# EAGLE schematic Dual_TPA6120_V0001 (EAGLE 6.4)

## Sheet 1 of 2: Power Supply
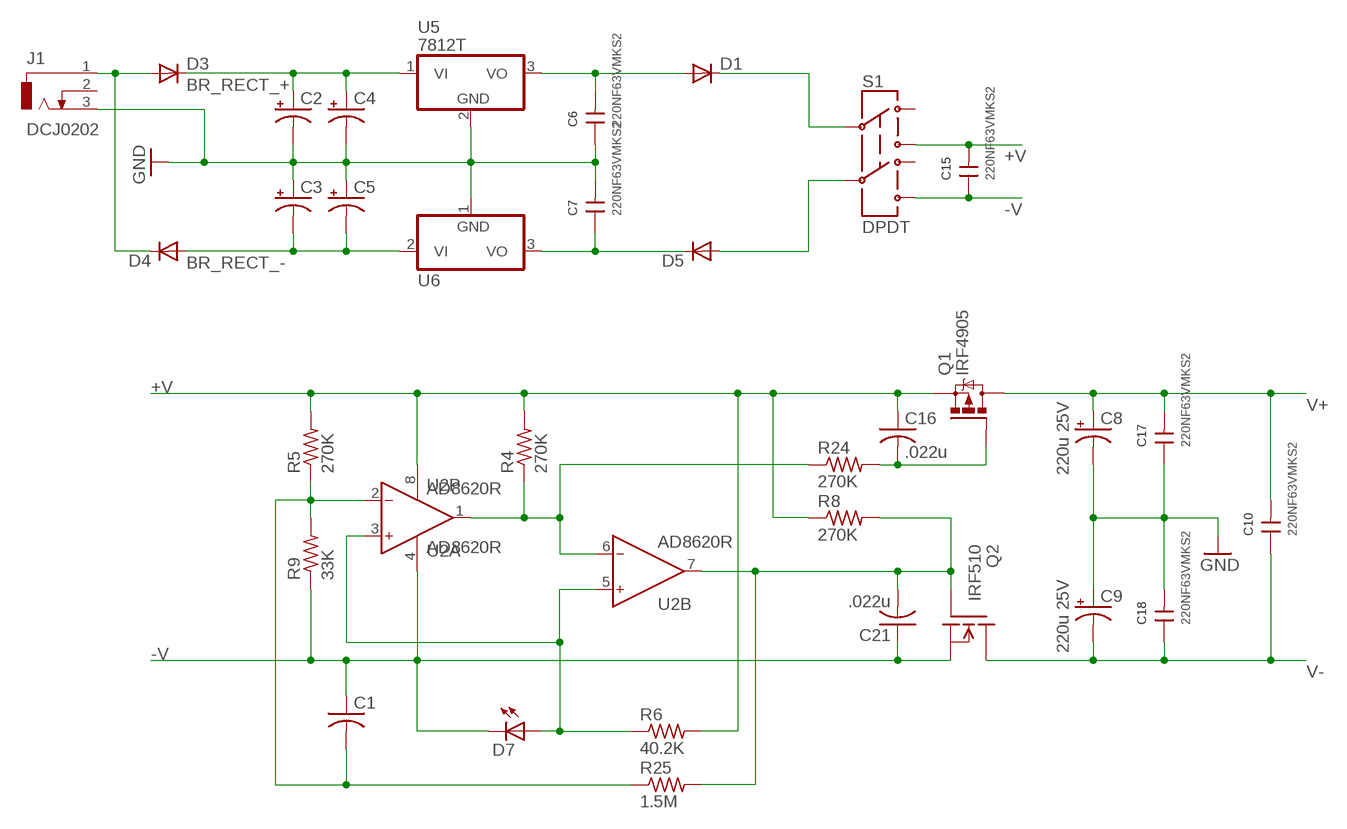
[diagram p0: schematic, sheet 1]

### Parts
C1  C-USC0603  [C0603]
C2  CPOL-USE7.5-16  [E7,5-16]
C3  CPOL-USE7.5-16  [E7,5-16]
C4  CPOL-USE7.5-16  [E7,5-16]
C5  CPOL-USE7.5-16  [E7,5-16]
C6  220NF63VMKS2  [3,0X7,5RM5,0]
C7  220NF63VMKS2  [3,0X7,5RM5,0]
C8  220u 25V  CPOL-USE3.5-10  [E3,5-10]
C9  220u 25V  CPOL-USE3.5-10  [E3,5-10]
C10  220NF63VMKS2  [3,0X7,5RM5,0]
C15  220NF63VMKS2  [3,0X7,5RM5,0]
C16  .022u  C-USC0603  [C0603]
C17  220NF63VMKS2  [3,0X7,5RM5,0]
C18  220NF63VMKS2  [3,0X7,5RM5,0]
C21  .022u  C-USC0603  [C0603]
D1  1N5060GP  [DO15-12]
D3  1N5060GP  [DO15-12]
D4  1N5060GP  [DO15-12]
D5  1N5060GP  [DO15-12]
D7  LED3MM  [LED3MM]
J1  DCJ0202  [DCJ0202]
Q1  IRF4905  [TO220BH]
Q2  IRF510  [TO220]
R4  270K  R-US_R0805  [R0805]
R5  270K  R-US_R0805  [R0805]
R6  40.2K  R-US_R0805  [R0805]
R8  270K  R-US_R0805  [R0805]
R9  33K  R-US_R0805  [R0805]
R24  270K  R-US_R0805  [R0805]
R25  1.5M  R-US_R0805  [R0805]
S1  DPDT  SWITCH-DPDTAYZ0202  [AYZ0202]
U2  AD8620R  [SO8]
U5  7812T  [TO220H]
U6  7912T  [TO220H]

### Nets
+V: C15.2 C16.1 Q1.S R4.2 R5.2 R6.2 R8.1 S1.3 U2.8(P:V+)
-V: C1.1 C15.1 C21.1 D7.K(C) Q2.3(S) R9.1 S1.6 U2.4(P:V-)
BR_RECT_+: C2.+ C4.+ D3.C U5.1(VI)
BR_RECT_-: C3.- C5.- D4.A U6.2(VI)
GND: C2.- C3.+ C4.- C5.+ C6.1 C7.2 C8.- C9.+ C17.1 C18.2 J1.3 U5.2(GND) U6.1(GND) ; also sheet 2
N$1: C6.2 D1.A U5.3(VO)
N$2: C1.2 R5.1 R9.2 R25.1 U2.2(A:IN-)
N$3: C7.1 D5.C U6.3(VO)
N$4: D7.A R6.1 U2.3(A:IN+) U2.5(B:IN+)
N$5: C21.2 Q2.1(G) R8.2 R25.2 U2.7(B:OUT)
N$6: R4.1 R24.1 U2.1(A:OUT) U2.6(B:IN-)
N$9: C16.2 Q1.G R24.2
N$21: D3.A D4.C J1.1
REG+: D1.C S1.2
REG-: D5.A S1.5
V+: C8.+ C10.2 C17.2 Q1.D ; also sheet 2
V-: C9.- C10.1 C18.1 Q2.2(D) ; also sheet 2
Unconnected: J1.2 S1.1 S1.4

## Sheet 2 of 2: Amp Section
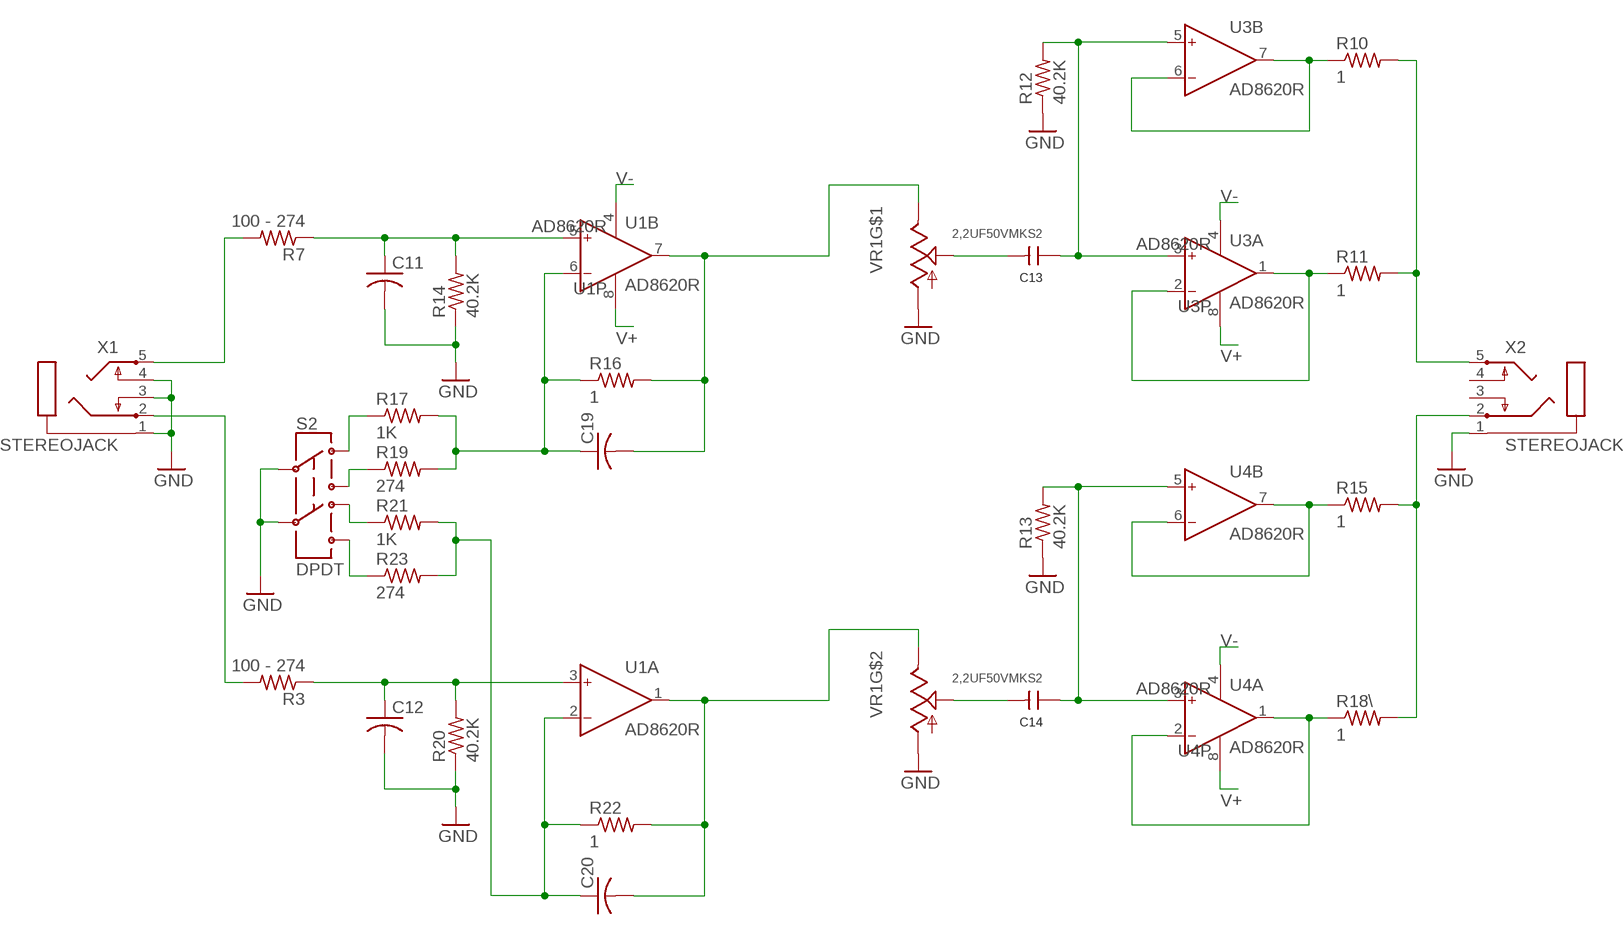
[diagram p1: schematic, sheet 2]

### Parts
C11  C-USC0603  [C0603]
C12  C-USC0603  [C0603]
C13  2,2UF50VMKS2  [7,2X13,0RM5,0]
C14  2,2UF50VMKS2  [7,2X13,0RM5,0]
C19  C-USC0603  [C0603]
C20  C-USC0603  [C0603]
R3  100 - 274  R-US_R1206  [R1206]
R7  100 - 274  R-US_R1206  [R1206]
R10  1  R-US_R1206  [R1206]
R11  1  R-US_R1206  [R1206]
R12  40.2K  R-US_R1206  [R1206]
R13  40.2K  R-US_R1206  [R1206]
R14  40.2K  R-US_R1206  [R1206]
R15  1  R-US_R1206  [R1206]
R16  1  R-US_R1206  [R1206]
R17  1K  R-US_R1206  [R1206]
R18\  1  R-US_R1206  [R1206]
R19  274  R-US_R1206  [R1206]
R20  40.2K  R-US_R1206  [R1206]
R21  1K  R-US_R1206  [R1206]
R22  1  R-US_R1206  [R1206]
R23  274  R-US_R1206  [R1206]
S2  DPDT  SWITCH-DPDTAYZ0202  [AYZ0202]
U1  AD8620R  [SO8]
U3  AD8620R  [SO8]
U4  AD8620R  [SO8]
VR1  ALPS_BLUE  [ALPS_RK27]
X1  STEREOJACK  [STX3100]
X2  STEREOJACK  [STX3100]

### Nets
GND: C11.2 C12.2 R12.1 R13.1 R14.1 R20.1 S2.2 S2.5 VR1.G1 VR1.G2 X1.1 X1.3 X1.4 X2.1 ; also sheet 1
N$7: R10.1 U3.6(B:IN-) U3.7(B:OUT)
N$8: R11.1 U3.1(A:OUT) U3.2(A:IN-)
N$10: R15.1 U4.6(B:IN-) U4.7(B:OUT)
N$11: R18\.1 U4.1(A:OUT) U4.2(A:IN-)
N$12: C19.2 R16.2 U1.7(B:OUT) VR1.I1
N$13: C20.2 R22.2 U1.1(A:OUT) VR1.I2
N$14: C14.2 VR1.O2
N$15: R10.2 R11.2 X2.5
N$17: R15.2 R18\.2 X2.2
N$18: C13.1 R12.2 U3.3(A:IN+) U3.5(B:IN+)
N$19: C14.1 R13.2 U4.3(A:IN+) U4.5(B:IN+)
N$20: C13.2 VR1.O1
N$22: R7.2 X1.5
N$23: R3.2 X1.2
N$24: C11.1 R7.1 R14.2 U1.5(B:IN+)
N$25: C12.1 R3.1 R20.2 U1.3(A:IN+)
N$27: C19.1 R16.1 R17.2 R19.2 U1.6(B:IN-)
N$28: C20.1 R21.2 R22.1 R23.2 U1.2(A:IN-)
N$30: R17.1 S2.1
N$31: R19.1 S2.3
N$32: R21.1 S2.4
N$33: R23.1 S2.6
V+: U1.8(P:V+) U3.8(P:V+) U4.8(P:V+) ; also sheet 1
V-: U1.4(P:V-) U3.4(P:V-) U4.4(P:V-) ; also sheet 1
Unconnected: X2.3 X2.4

## Library data of the parts
C1 C11 C12 C16 C19-C21 = rcl:C-US: CAPACITOR, American symbol
C2-C5 C8 C9 = rcl:CPOL-US: POLARIZED CAPACITOR, American symbol
C6 C7 C10 C15 C17 C18 = wima_c:220NF63V
C13 C14 = wima_c:2,2UF50V
D1 D3-D5 = diode-1:1N5060GP: DIODE controlled avalanche rectifier
D7 = adafruit:LED: LED OSRAM: - CHIPLED LG R971, LG N971, LY N971, LG Q971, LY Q971, LO R971, LY R971 LH N974, LH R974 LS Q976, LO Q976, LY Q976 LO Q996 - Hyper CHIPLED LW Q18S LB Q993, LB Q99A, LB R99A - SideLED LS A670, LO A670, LY A670, LG A670, LP A670 LB A673, LV A673, LT A673, LW A673 LH A674 LY A675 LS A676, LA A676, LO A676, LY A676, LW A676 LS A679, LY A679, LG A679 - Hyper Micro SIDELED® LS Y876, LA Y876, LO Y876, LY Y876 LT Y87S - SmartLED LW L88C, LW L88S LB L89C, LB L89S, LG L890 LS L89K, LO L89K, LY L89K LS L896, LA L896, LO L896, LY L896 - TOPLED LS T670, LO T670, LY T670, LG T670, LP T670 LSG T670, LSP T670, LSY T670, LOP T670, LYG T670 LG T671, LOG T671, LSG T671 LB T673, LV T673, LT T673, LW T673 LH T674 LS T676, LA T676, LO T676, LY T676, LB T676, LH T676, LSB T676, LW T676 LB T67C, LV T67C, LT T67C, LS T67K, LO T67K, LY T67K, LW E67C LS E67B, LA E67B, LO E67B, LY E67B, LB E67C, LV E67C, LT E67C LW T67C LS T679, LY T679, LG T679 LS T770, LO T770, LY T770, LG T770, LP T770 LB T773, LV T773, LT T773, LW T773 LH T774 LS E675, LA E675, LY E675, LS T675 LS T776, LA T776, LO T776, LY T776, LB T776 LHGB T686 LT T68C, LB T68C - Hyper Mini TOPLED® LB M676 - Mini TOPLED Santana® LG M470 LS M47K, LO M47K, LY M47K Source: http://www.osram.convergy.de/
J1 = con-jack:DCJ0202: DC POWER JACK Source: DCJ0202.pdf; OC_FARNELL: unknown; OC_NEWARK: unknown
Q1 = transistor-power:IRF4905: P-Channel HEXFET® Power MOSFET RDS(on)= 0.02 Ohm, ID = -74A Source: http://www.irf.com/product-info/datasheets/data/irf4905pbf.pdf
Q2 = transistor-fet+irf7201:IRF510: N-Channel Enhancement MOSFET (HEXFET); 100V; 5,6A; 0,54Ohm
R3-R17 R18\ R19-R25 = rcl:R-US_: RESISTOR, American symbol
S1 S2 = SparkFun-Electromechanical:SWITCH-DPDT: DPDT Version of the COM-00597; PROD_ID: SWCH-08179
U1-U4 = analog-devices:AD8620: Precision, Very Low Noise, Low Input Bias Current, Wide Bandwidth JFET Operational Amplifiers Source: http://www.analog.com/static/imported-files/data_sheets/AD8610_8620.pdf; MF: ALTERA CORPORATION; MPN: AD8620ARZ; OC_FARNELL: 9994386; OC_NEWARK: 59K6972
U5 = linear:78*: Positive VOLTAGE REGULATOR Source: http://cache.national.com/ds/LM/LM78L05.pdf http://www.fairchildsemi.com/ds/LM/LM7805.pdf
U6 = linear:79*: Negative VOLTAGE REGULATOR
VR1 = audio-pots:ALPS_BLUE: Alps Blue potentiometer
X1 X2 = adafruit:STEREOJACK: MIC/HEADPHONE JACK Stereo jack with two switches. Kycon STX3100, CUI SJ1-3555NG and/or 4UCon 05544